# Altium schematic sheet 1_cover.SchDoc: Cover and block diagram
size A4; ENG_APP_DATE: --/--/--; DSN_APP_DATE: --/--/--; CHK_APP_DATE: --/--/--; OrganizationName: Pluton UPV; Address1: Universitat Politècnica; Address2: de València (UPV); Address3: Camí de Vera, València; Address4: Spain; SheetNumber: 1; SheetTotal: 12
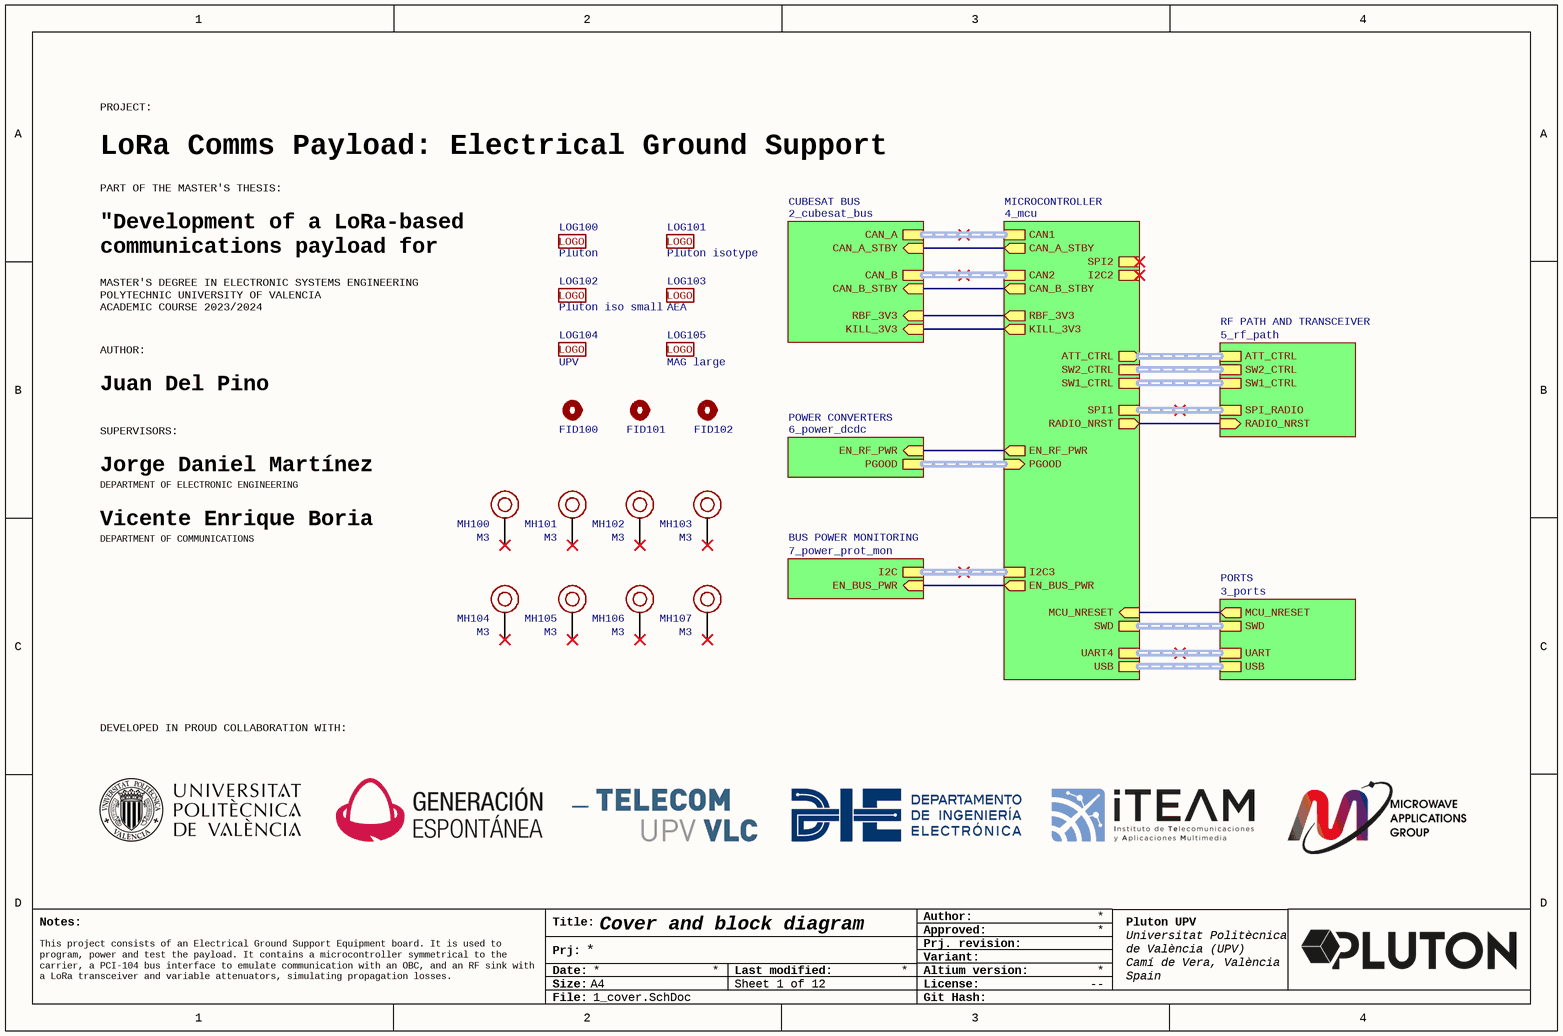
[diagram p0: 1_cover.SchDoc]

## Parts
FID100  Fiducial Mark  [Fiducial_1_3_mm]  (value not drawn)  (no BOM)
FID101  Fiducial Mark  [Fiducial_1_3_mm]  (value not drawn)  (no BOM)
FID102  Fiducial Mark  [Fiducial_1_3_mm]  (value not drawn)  (no BOM)
LOG100  Pluton  [logo_pluton]  (no BOM)
LOG101  Pluton isotype  [logo_pluton_isotype]  (no BOM)
LOG102  Pluton iso small  [logo_pluton_isotype_small]  (no BOM)
LOG103  AEA  [logo_aea]  (no BOM)
LOG104  UPV  [logo_upv]  (no BOM)
LOG105  MAG large  [logo_mag_big]  (no BOM)
MH100  M3  [MH Cubesat M3]  (no BOM)
MH101  M3  [MH Cubesat M3]  (no BOM)
MH102  M3  [MH Cubesat M3]  (no BOM)
MH103  M3  [MH Cubesat M3]  (no BOM)
MH104  M3  [MH Cubesat M3]  (no BOM)
MH105  M3  [MH Cubesat M3]  (no BOM)
MH106  M3  [MH Cubesat M3]  (no BOM)
MH107  M3  [MH Cubesat M3]  (no BOM)

## Sub-sheets
BUS POWER MONITORING = 7_power_prot_mon: I2C (harness I2C), EN_BUS_PWR (in)
CUBESAT BUS = 2_cubesat_bus: CAN_A (harness CAN), CAN_B (harness CAN), CAN_A_STBY (in), CAN_B_STBY (in), KILL_3V3 (in), RBF_3V3 (in)
MICROCONTROLLER = 4_mcu: SPI1 (harness SPI), SPI2 (harness SPI), CAN1 (harness CAN), CAN2 (harness CAN), I2C3 (harness I2C), SWD (harness SWD), USB (harness USB), UART4 (harness UART), MCU_NRESET (in), CAN_B_STBY (out), CAN_A_STBY (out), ATT_CTRL (out, harness ATT_CTRL), RBF_3V3 (out), PGOOD (in, harness PGOOD), EN_RF_PWR (out), KILL_3V3 (out), SW2_CTRL (harness SW_CTRL), SW1_CTRL (harness SW_CTRL), RADIO_NRST (out), I2C2 (harness I2C), EN_BUS_PWR (out)
PORTS = 3_ports: SWD (harness SWD), MCU_NRESET (out), UART (harness UART), USB (harness USB)
POWER CONVERTERS = 6_power_dcdc: PGOOD (harness PGOOD), EN_RF_PWR (in)
RF PATH AND TRANSCEIVER = 5_rf_path: SW2_CTRL (harness SW_CTRL), SW1_CTRL (harness SW_CTRL), ATT_CTRL (harness ATT_CTRL), SPI_RADIO (harness SPI), RADIO_NRST (in)

## Nets
(unnamed): sheet CUBESAT BUS/CAN_A_STBY, sheet MICROCONTROLLER/CAN_A_STBY
(unnamed): sheet CUBESAT BUS/CAN_B_STBY, sheet MICROCONTROLLER/CAN_B_STBY
(unnamed): sheet CUBESAT BUS/KILL_3V3, sheet MICROCONTROLLER/KILL_3V3
(unnamed): sheet CUBESAT BUS/RBF_3V3, sheet MICROCONTROLLER/RBF_3V3
(unnamed): sheet POWER CONVERTERS/EN_RF_PWR, sheet MICROCONTROLLER/EN_RF_PWR
(unnamed): sheet MICROCONTROLLER/MCU_NRESET, sheet PORTS/MCU_NRESET
(unnamed): sheet MICROCONTROLLER/RADIO_NRST, sheet RF PATH AND TRANSCEIVER/RADIO_NRST
(unnamed): sheet MICROCONTROLLER/EN_BUS_PWR, sheet BUS POWER MONITORING/EN_BUS_PWR

Not connected (* = marked no-connect by the designer): MH100 1*; MH101 1*; MH102 1*; MH103 1*; MH104 1*; MH105 1*; MH106 1*; MH107 1*

## Buses and harness runs
harness sheet BUS POWER MONITORING/I2C = sheet MICROCONTROLLER/I2C3
harness sheet CUBESAT BUS/CAN_A = sheet MICROCONTROLLER/CAN1
harness sheet CUBESAT BUS/CAN_B = sheet MICROCONTROLLER/CAN2
harness sheet MICROCONTROLLER/ATT_CTRL = sheet RF PATH AND TRANSCEIVER/ATT_CTRL
harness sheet MICROCONTROLLER/PGOOD = sheet POWER CONVERTERS/PGOOD
harness sheet MICROCONTROLLER/SPI1 = sheet RF PATH AND TRANSCEIVER/SPI_RADIO
harness sheet MICROCONTROLLER/SW1_CTRL = sheet RF PATH AND TRANSCEIVER/SW1_CTRL
harness sheet MICROCONTROLLER/SW2_CTRL = sheet RF PATH AND TRANSCEIVER/SW2_CTRL
harness sheet MICROCONTROLLER/SWD = sheet PORTS/SWD
harness sheet MICROCONTROLLER/UART4 = sheet PORTS/UART
harness sheet MICROCONTROLLER/USB = sheet PORTS/USB

## Notes on the sheet
- PROJECT:
- LoRa Comms Payload: Electrical Ground Support Equipment
- PART OF THE MASTER'S THESIS:
- (near LOG102) MASTER'S DEGREE IN ELECTRONIC SYSTEMS ENGINEERING
  POLYTECHNIC UNIVERSITY OF VALENCIA
  ACADEMIC COURSE 2023/2024
- (near LOG100) "Development of a LoRa-based communications payload for CubeSat"
- AUTHOR:
- Juan Del Pino Mena
- SUPERVISORS:
- Jorge Daniel Martínez Pérez
- Vicente Boria Esbert
- DEPARTMENT OF ELECTRONIC ENGINEERING
- Vicente Enrique Boria Esbert
- DEPARTMENT OF COMMUNICATIONS
- DEVELOPED IN PROUD COLLABORATION WITH:
- This project consists of an Electrical Ground Support Equipment board. It is used to program, power and test the payload. It contains a microcontroller symmetrical to the carrier, a PCI-104 bus interface to emulate communication with an OBC, and an RF sink with a LoRa transceiver and variable attenuators, simulating propagation losses.
- Notes:
- Title:
- Author:
- Approved:
- Date:
- Prj:
- Size:
- A4
- Last modified:
- Altium version:
- Variant:
- Prj. revision:
- License:
- --
- File:
- Git Hash:
- (in symbol Logo) LOGO

## Library data of the parts
FID100-FID102 = Fiducial Mark: FIducial Mark (concentric 1 mm, 3 mm)
LOG100-LOG105 = Logo
MH100-MH107 = MH M3